# EasyEDA Pro project Jalousee PCB.eprj, schematic Schematic1_2
Create Date: 2023-09-14; Page Name: P1; Project Name: Jalousee PCB; Schematic Name: Schematic1_2; Update Date: 2023-09-14; Company: EasyEDA.com; Drawed: EasyEDA Pro; Page Size: A4; Part Number: JLCPCB-002; Reviewed: EasyEDA Pro; Version: V0.1
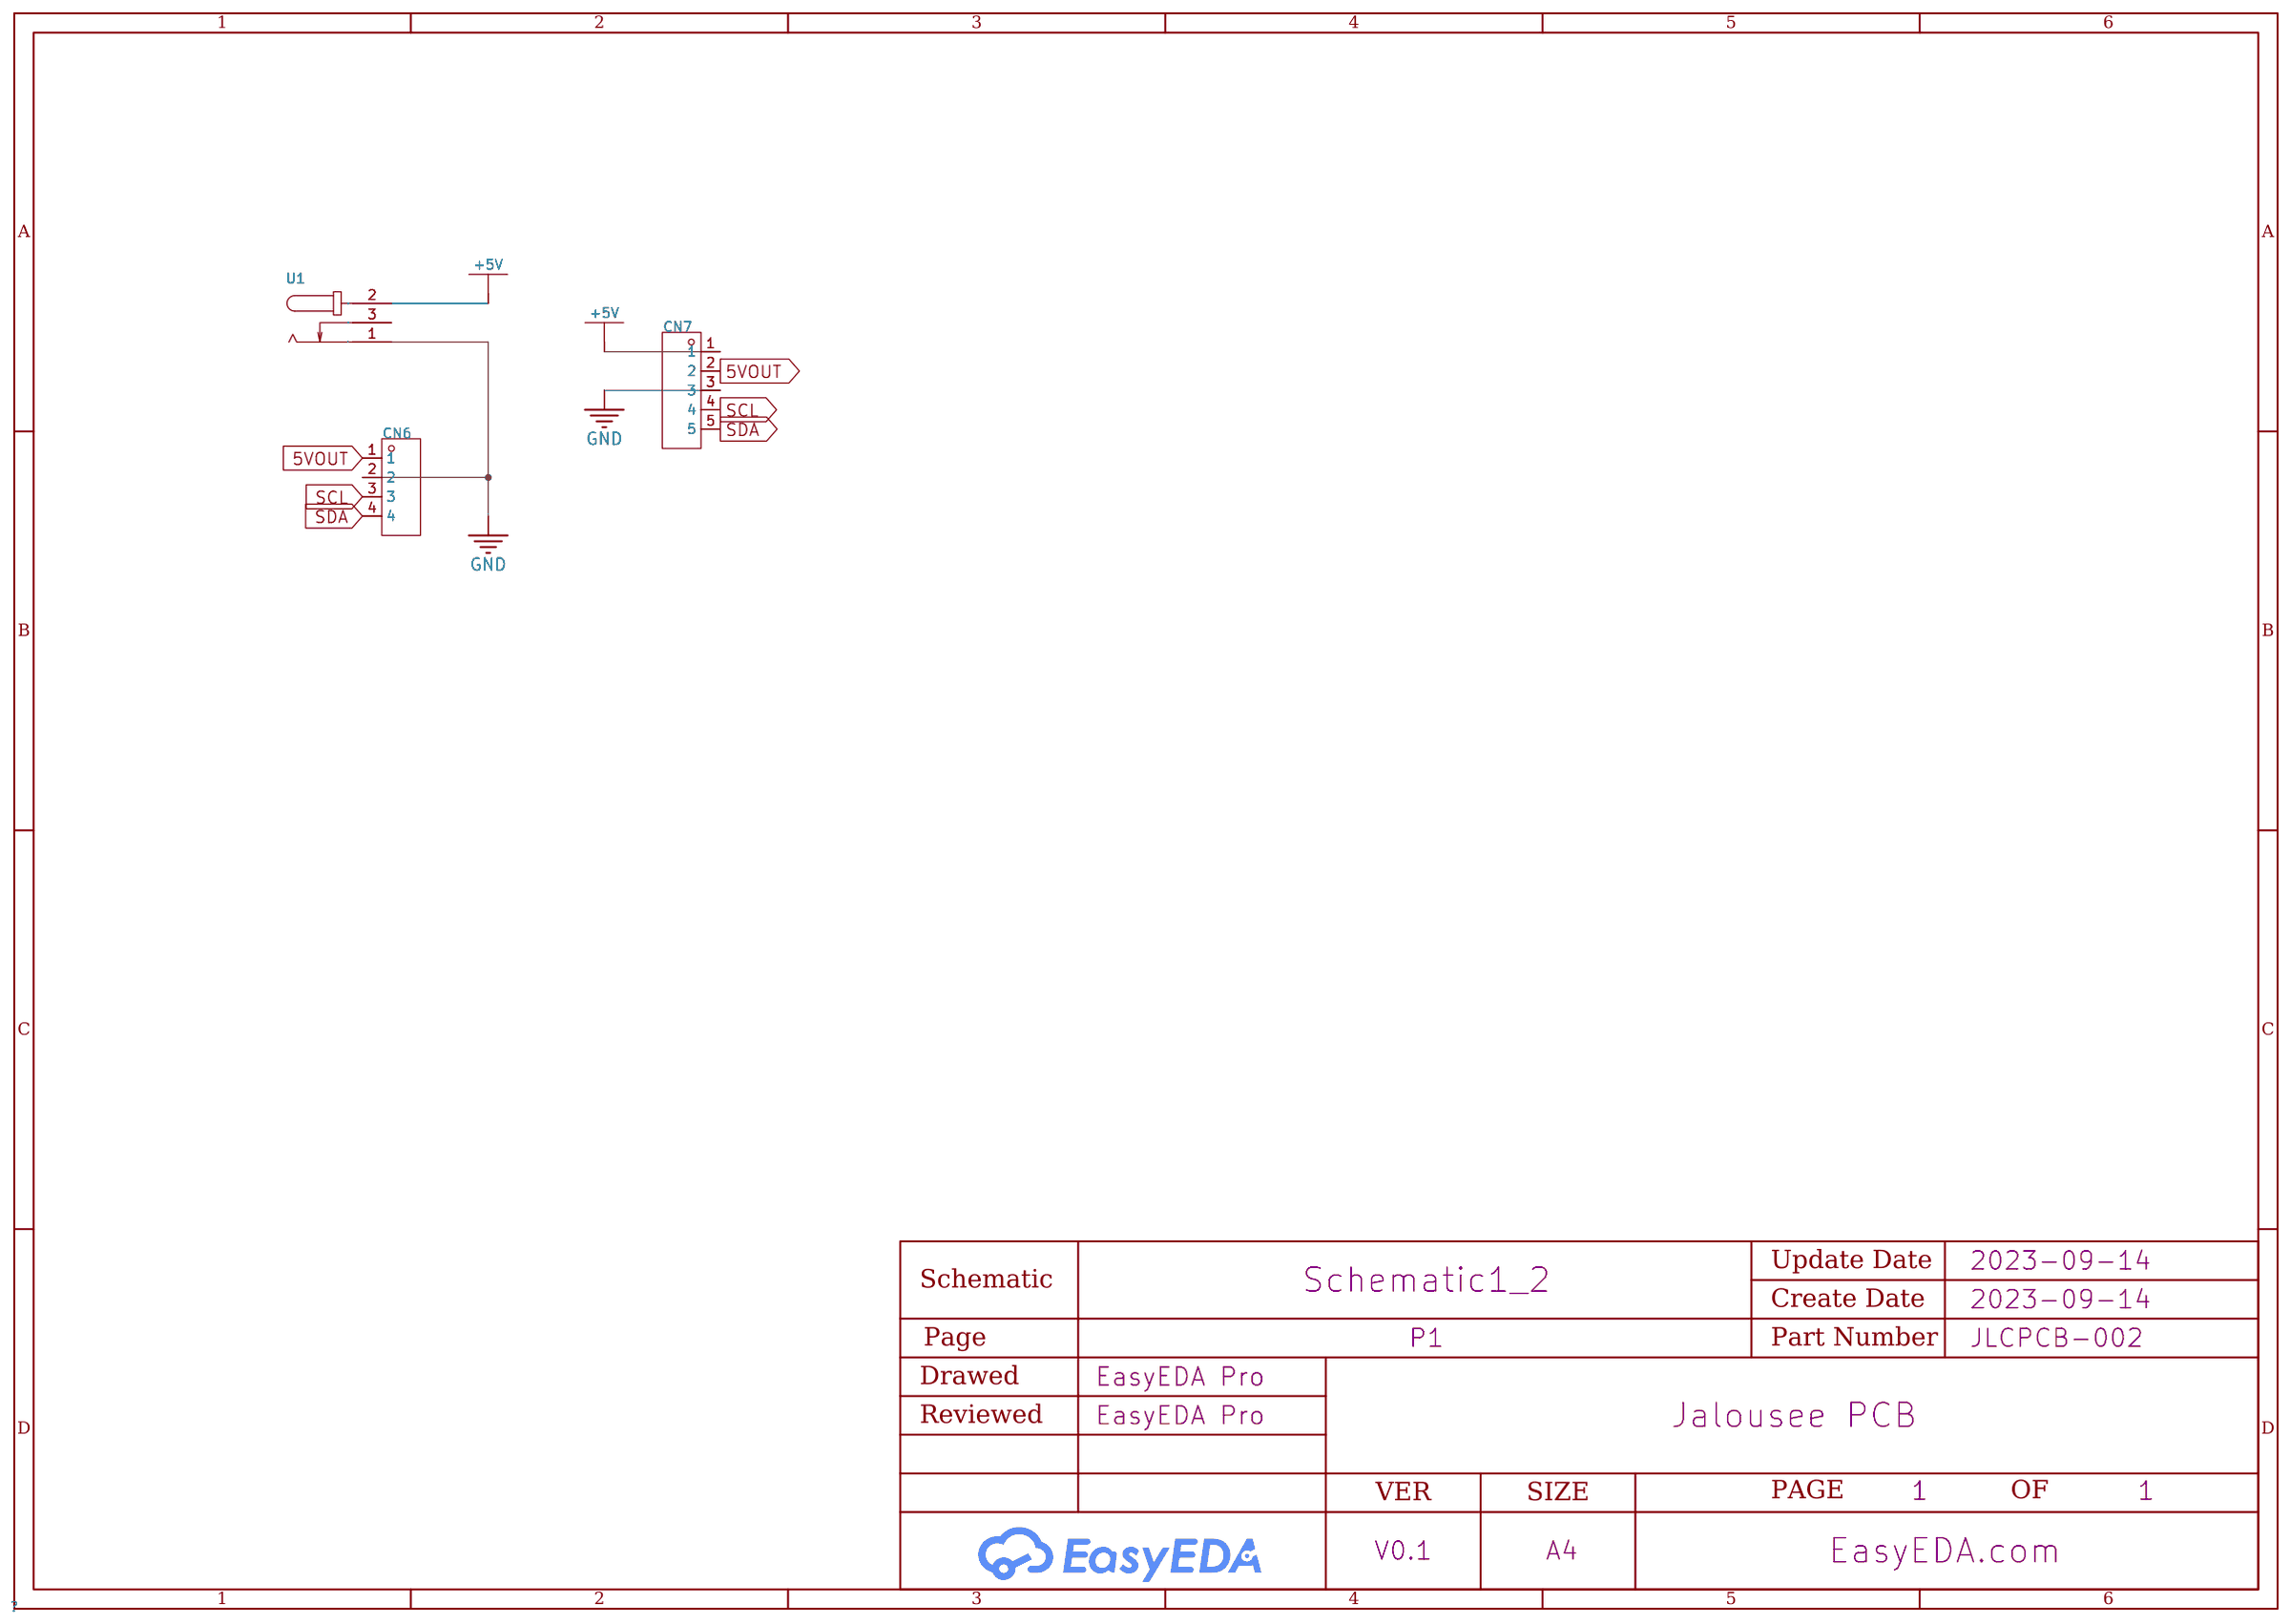
[diagram p7: schematic sheet]

## Parts
CN6  HC-1.25-4A  [CONN-TH_4P-P1.25_HCTL_HC-1.25-4A]
CN7  HC-1.25-5AW  [CONN-TH_5P-P1.25_HCTL_HC-1.25-5AW]
U1  DC-003-2A-1.0  [DC-IN-TH_XKB_DC-003-2A-1.0]

## Library data of the parts
CN6 = HC-1.25-4A: Reference Series:- Pitch:1.25mm Pins Structure:1x4P Number of Rows:1 Number of PINs Per Row:4 Row Spacing:- Gender:公型插针 Mounting Style:Straight Current Rating (Max):1A Operating Temperature Range:-25℃~+85℃ Operating Temperature Range:-25℃~+85℃; LCSC Part Name: 1.25mm 1x4P 直插; Supplier Part: C2845522; Manufacturer: HCTL(华灿天禄); Supplier Footprint: 插件,P=1.25mm; JLCPCB Part Class: Extended Part; Datasheet: https://atta.szlcsc.com/upload/public/pdf/source/20210729/C2845520_89EAA22C8D4DE2FB8A253230326912FB.pdf; Supplier: LCSC; Pitch: 1.25mm; Pins Structure: 1x4P; Number of Rows: 1; Number of PINs Per Row: 4; Gender: 公型插针; Mounting Style: Straight; Current Rating (Max): 1A; Operating Temperature Range: -25℃~+85℃
CN7 = HC-1.25-5AW: Reference Series:- Pitch:1.25mm Pins Structure:1x5P Number of Rows:1 Number of PINs Per Row:5 Row Spacing:- Gender:公型插针 Mounting Style:Shrouded Current Rating (Max):1A Operating Temperature Range:-25℃~+85℃ Operating Temperature Range:-25℃~+85℃; LCSC Part Name: 1.25mm 1x5P 弯插; Supplier Part: C2845538; Manufacturer: HCTL(华灿天禄); Supplier Footprint: 弯插,P=1.25mm; JLCPCB Part Class: Extended Part; Datasheet: https://atta.szlcsc.com/upload/public/pdf/source/20210729/C2845535_17B4C65D5133EDBE0A07B8E05D9E3662.pdf; Supplier: LCSC; Pitch: 1.25mm; Pins Structure: 1x5P; Number of Rows: 1; Number of PINs Per Row: 5; Gender: 公型插针; Mounting Style: Shrouded; Current Rating (Max): 1A; Operating Temperature Range: -25℃~+85℃
U1 = DC-003-2A-1.0: Connector Type:DC Power Receptacle Mounting Style:Shrouded Inside Contact Diameter:1mm Outside Contact Diameter:3.8mm Current Rating (Max):2A Voltage Rating (Max):12V Contact Material:Brass Operating Temperature Range:-20℃~+70℃ Operating Temperature Range; LCSC Part Name: DC电源插座 内径:1mm 外径:3.8mm; Supplier Part: C2880542; Manufacturer: XKB Connectivity(中国星坤); Supplier Footprint: 插件; JLCPCB Part Class: Extended Part; Datasheet: https://atta.szlcsc.com/upload/public/pdf/source/20211011/3F2EC04C24AA416DCE775980A9CECDAB.pdf; Supplier: LCSC; Connector Type: DC Power Receptacle; Mounting Style: Shrouded; Inside Contact Diameter: 1mm; Outside Contact Diameter: 3.8mm; Current Rating (Max): 2A; Voltage Rating (Max): 12V; Contact Material: Brass; Operating Temperature Range: -20℃~+70℃; Welding Temperature (Max): 260℃

## Nets
5VOUT: CN6.1 CN7.2
+5V: CN7.1 U1.2
GND: CN6.2 CN7.3 U1.1
SCL: CN6.3 CN7.4
SDA: CN6.4 CN7.5

Not connected (* = marked no-connect by the designer): U1 3
